# EAGLE schematic Active_Volume (EAGLE 6.3)

## Sheet 1 of 2
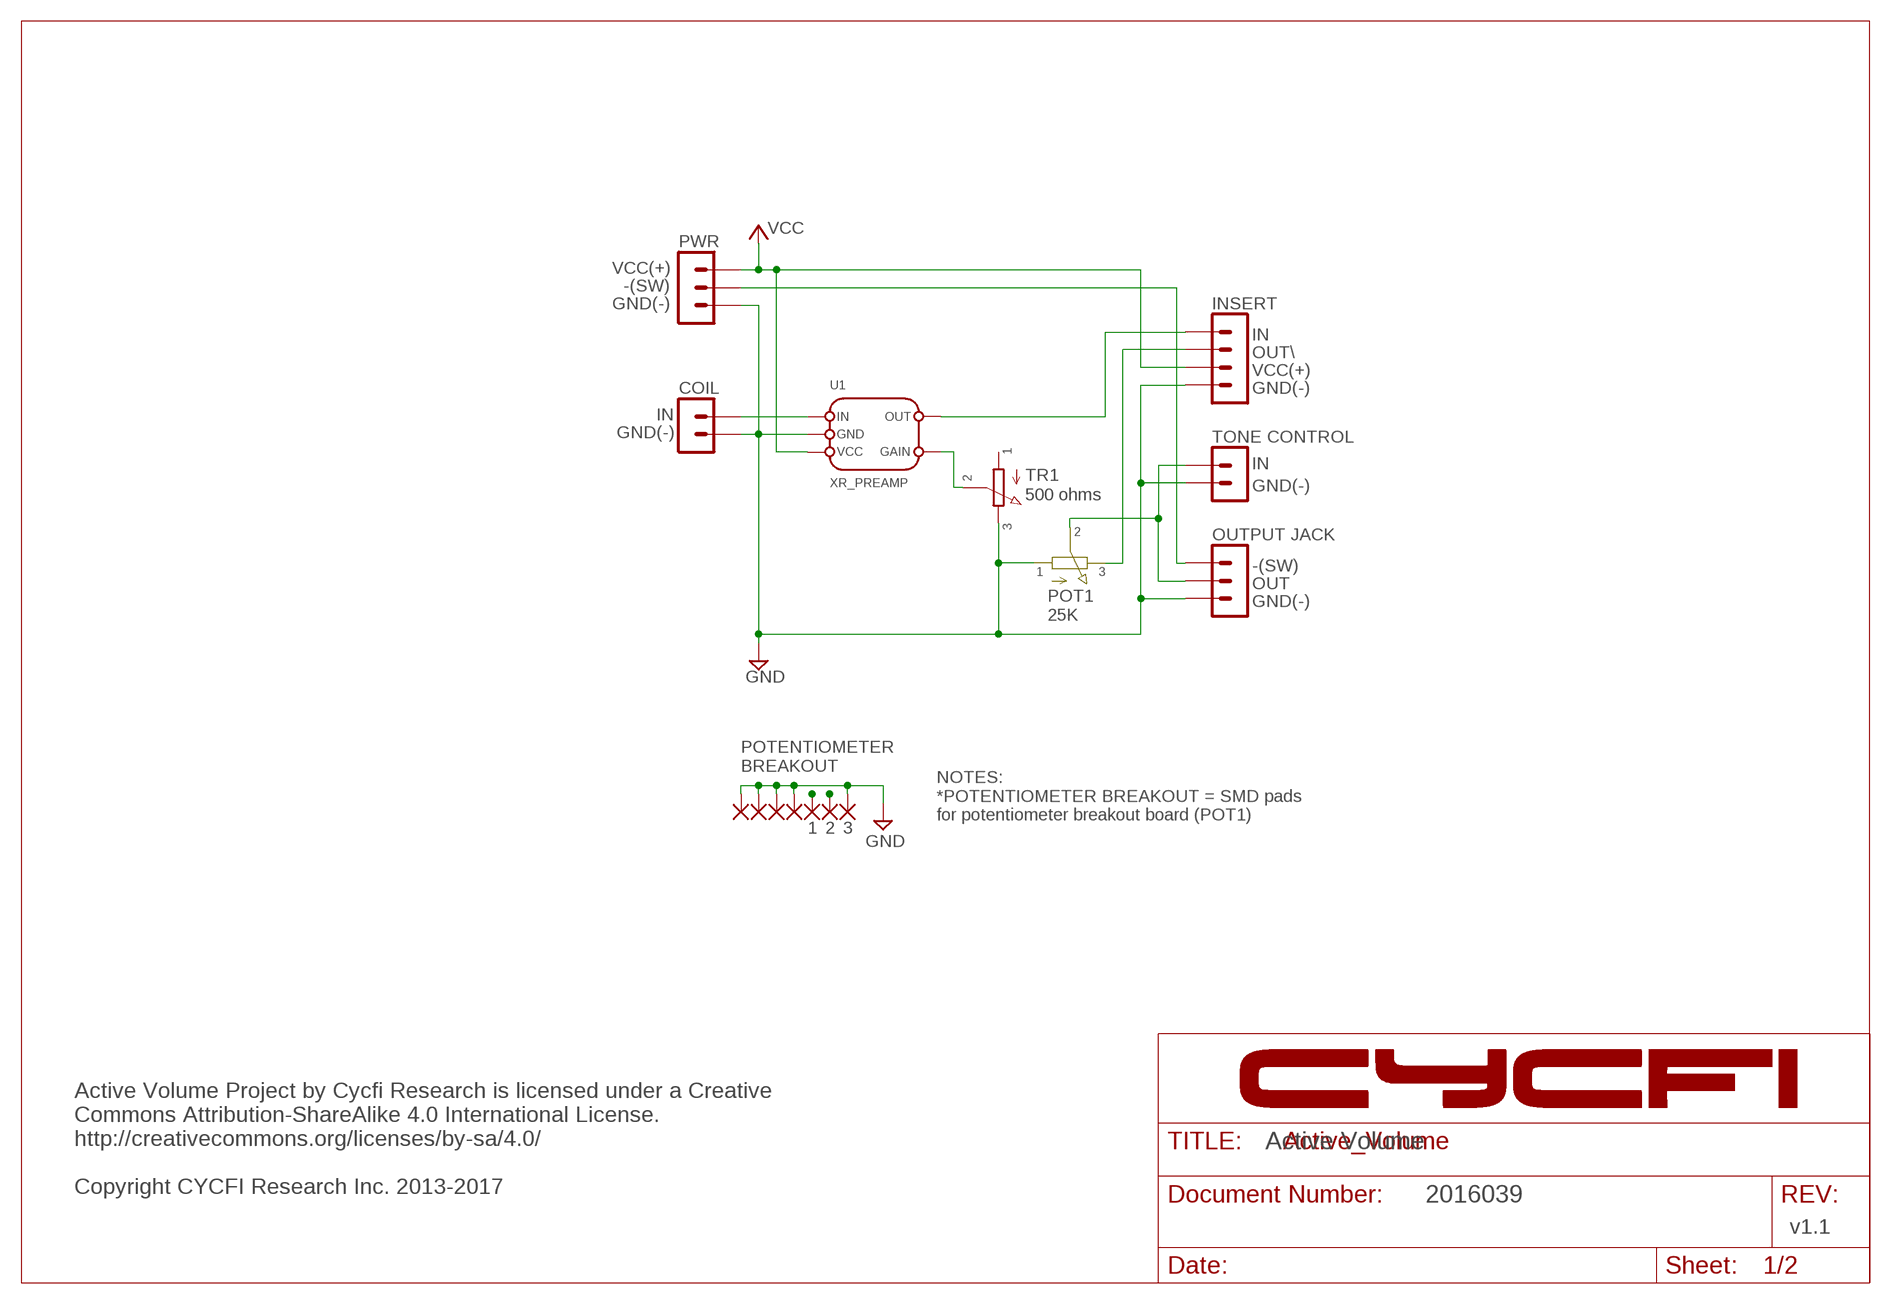
[diagram p0: schematic, sheet 1]

### Parts
PAD1  SMD2  [SMD1,27-2,54]
PAD2  SMD2  [SMD1,27-2,54]
PAD3  SMD2  [SMD1,27-2,54]
PAD4  SMD2  [SMD1,27-2,54]
PAD5  SMD2  [SMD1,27-2,54]
PAD6  SMD2  [SMD1,27-2,54]
PAD7  SMD2  [SMD1,27-2,54]
TR1  TC33X-2-201E  [TC33X-2-201E]
U1  XR_PREAMP  [XR_PREAMP_V1.5]

### Nets
GND: PAD1.1(P) PAD4.1(P) PAD5.1(P) PAD6.1(P) PAD7.1(P) TR1.P$3 U1.GND ; also sheet 2
INPUT: U1.IN ; also sheet 2
N$1: TR1.P$2 U1.GAIN
OUT(PREAMP): U1.OUT ; also sheet 2
OUT(SEL): PAD2.1(P) ; also sheet 2
OUT(VOL): PAD3.1(P) ; also sheet 2
VCC: U1.VCC ; also sheet 2
Unconnected: TR1.P$1

### Notes on the sheet
- PWR
- VCC(+)
- -(SW)
- GND(-) | INSERT
- IN
- OUT\
- VCC(+)
- COIL | GND(-)
- IN
- GND(-) | TONE CONTROL
- IN
- GND(-)
- 500 ohms
- 2
- OUTPUT JACK
- -(SW)
- 1 | 3
- OUT
- GND(-)
- POT1
  25K
- POTENTIOMETER
  BREAKOUT
- NOTES:
  *POTENTIOMETER BREAKOUT = SMD pads
  for potentiometer breakout board (POT1)
- 1 | 2 | 3
- Active Volume
- Active Volume Project by Cycfi Research is licensed under a Creative
  Commons Attribution-ShareAlike 4.0 International License. 
  http://creativecommons.org/licenses/by-sa/4.0/ 
  
  Copyright CYCFI Research Inc. 2013-2017
- 2016039
- v1.1

## Sheet 2 of 2
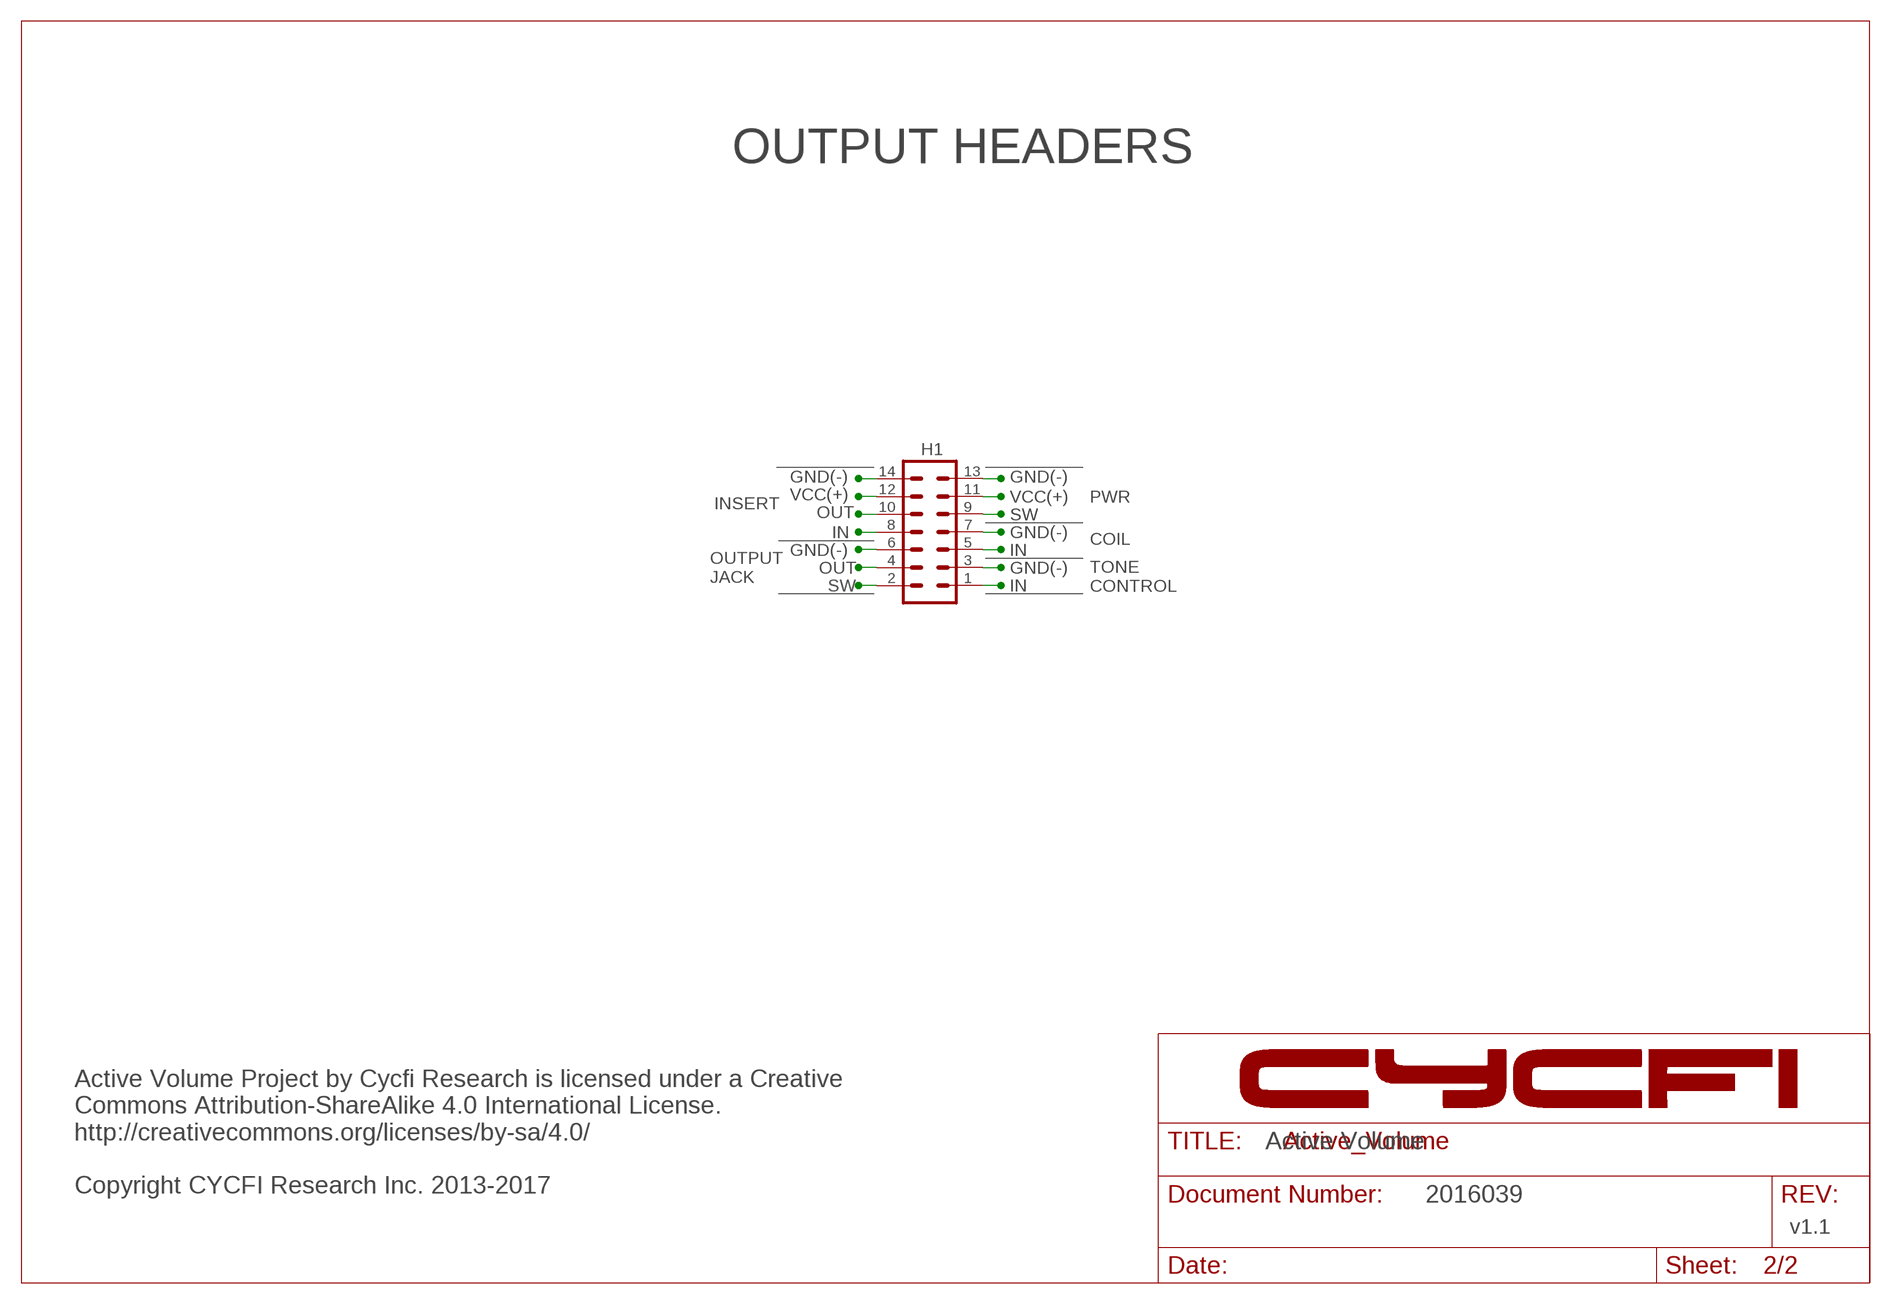
[diagram p1: schematic, sheet 2]

### Parts
H1  MA07-2  [MA07-2]

### Nets
GND: H1.3 H1.6 H1.7 H1.13 H1.14 ; also sheet 1
INPUT: H1.5 ; also sheet 1
OUT(PREAMP): H1.8 ; also sheet 1
OUT(SEL): H1.10 ; also sheet 1
OUT(VOL): H1.1 H1.4 ; also sheet 1
SW: H1.2 H1.9 ; also sheet 1
VCC: H1.11 H1.12 ; also sheet 1

### Notes on the sheet
- OUTPUT HEADERS
- GND(-) | GND(-)
- VCC(+) | VCC(+) | PWR
- INSERT
- OUT | SW
- IN | GND(-)
- COIL
- GND(-) | IN
- OUT | GND(-)
- OUTPUT
  JACK
- SW | IN
- TONE
  CONTROL
- Active Volume
- Active Volume Project by Cycfi Research is licensed under a Creative
  Commons Attribution-ShareAlike 4.0 International License. 
  http://creativecommons.org/licenses/by-sa/4.0/ 
  
  Copyright CYCFI Research Inc. 2013-2017
- 2016039
- v1.1

## Library data of the parts
H1 = con-lstb:MA07-2: PIN HEADER; OC_FARNELL: unknown; OC_NEWARK: unknown
PAD1-PAD7 = wirepad:SMD2: SMD PAD
TR1 = CYCFI_Passive:TC33X-2-201E
U1 = CYCFI_Module_castellated:XR_PREAMP